# EAGLE schematic PiPowerHat (EAGLE 7.4.0)
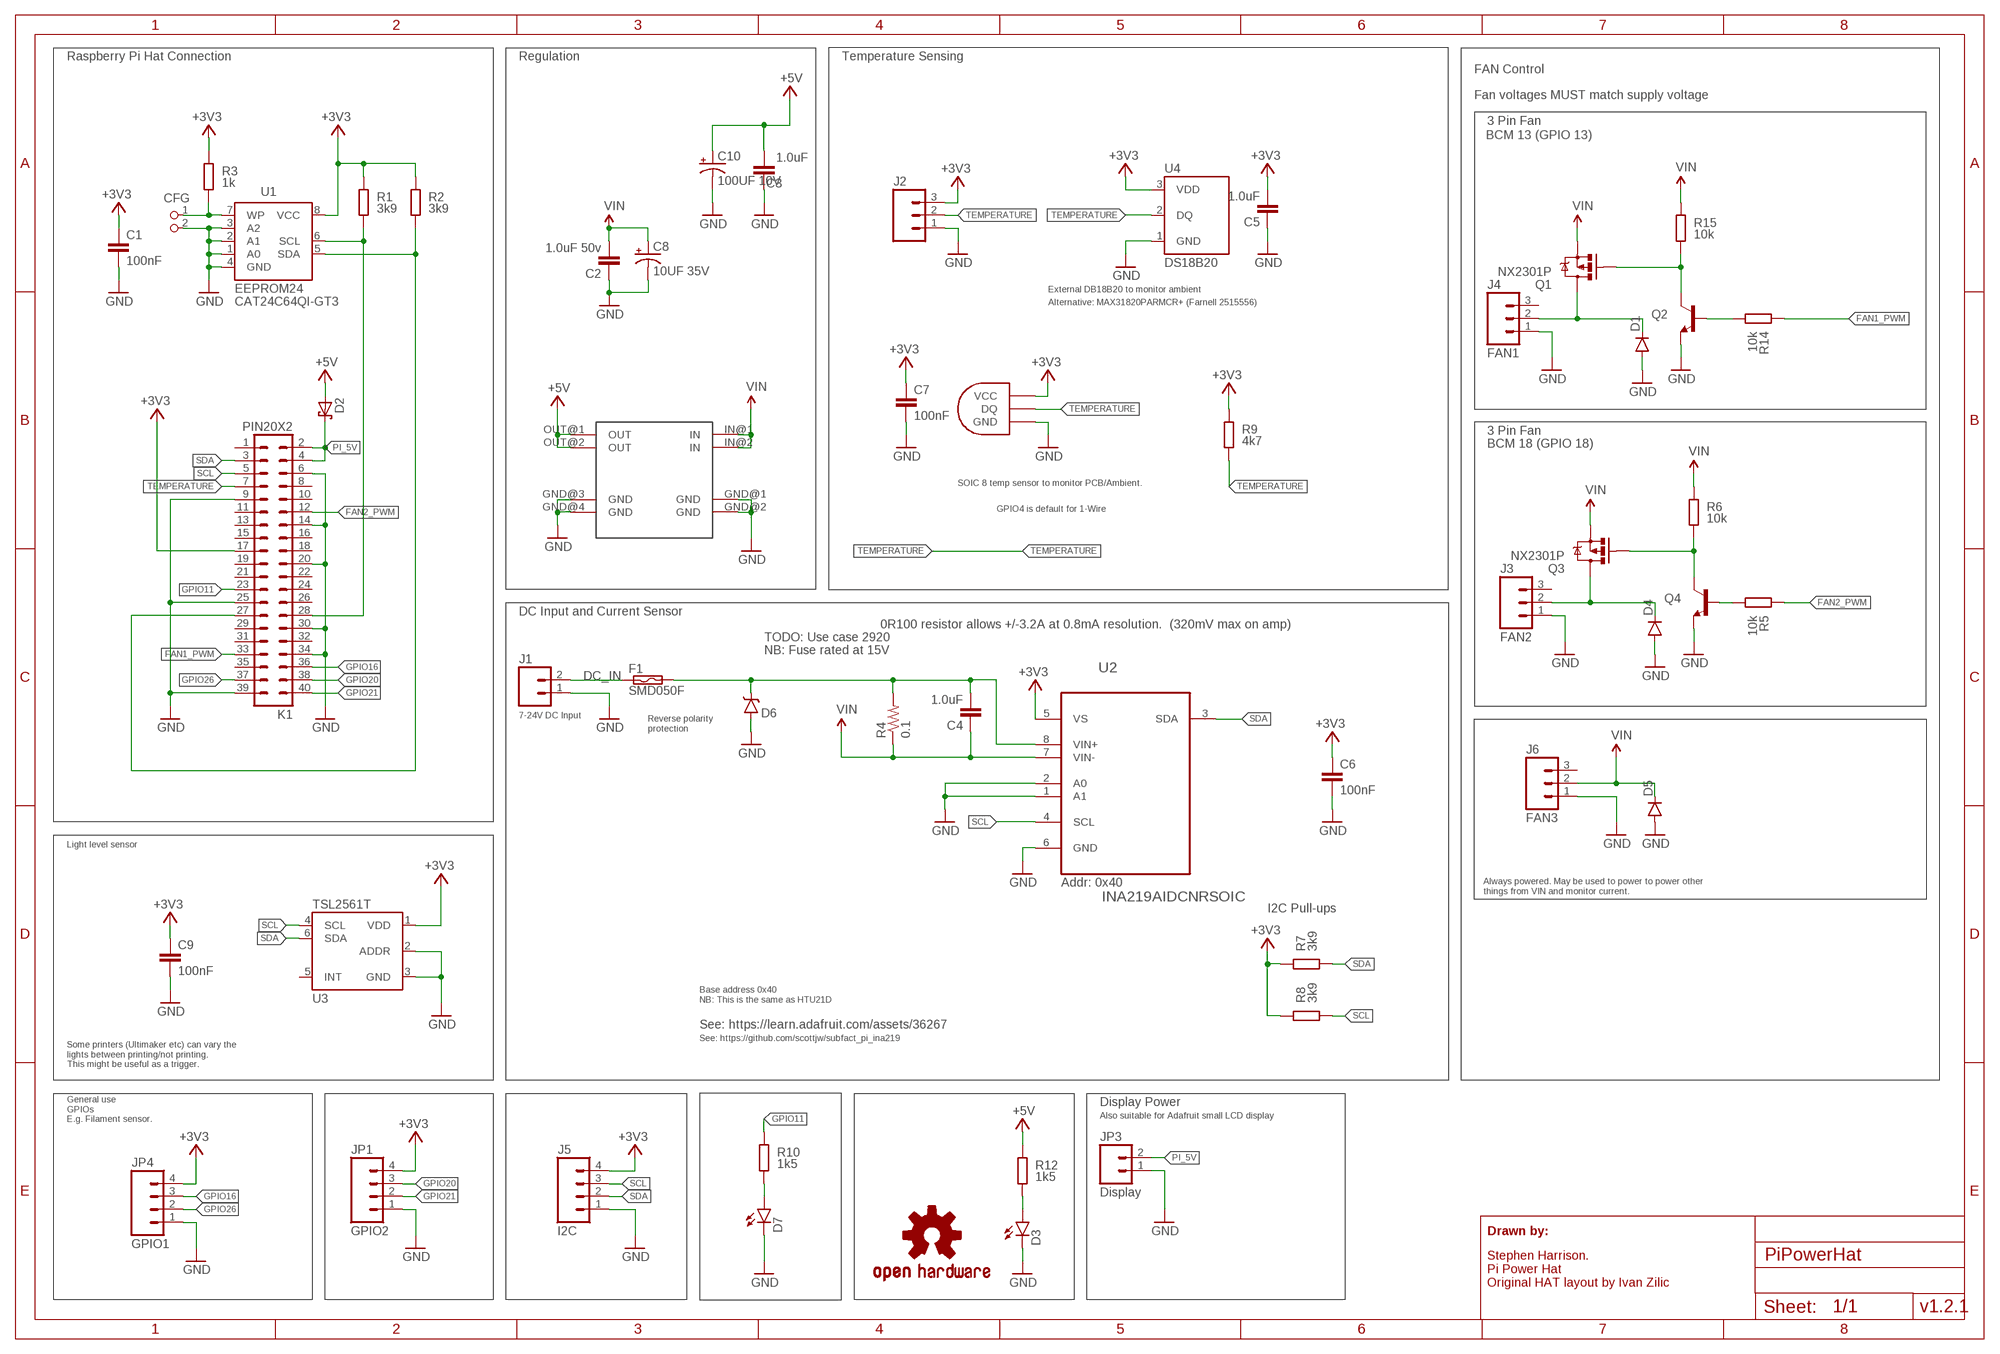
[diagram p0: schematic, sheet 1]

## Parts
C1  100nF  C-EUC0805K  [C0805K]
C2  1.0uF 50v  1.0UF-25V-+80/-20(0805)"  [0805-CAP]
C3  1.0uF  1.0UF-25V-+80/-20(0805)"  [0805-CAP]
C4  1.0uF  1.0UF-25V-+80/-20(0805)"  [0805-CAP]
C5  1.0uF  1.0UF-25V-+80/-20(0805)"  [0805-CAP]
C6  100nF  C-EUC0805K  [C0805K]
C7  100nF  C-EUC0805K  [C0805K]
C8  10UF 35V  10UF-25V-10%(SMT-TANT)  [EIA6032-NOM]
C9  100nF  C-EUC0805K  [C0805K]
C10  100UF 10V  10UF-25V-10%(SMT-TANT)  [EIA6032-NOM]
CFG  PIN2_100  [PIN_W_2]
D1  DIODESOD123  [SOD-123]
D2  MBRS340T3G  SCHOTTKY-DIODESMC  [SMC]
D3  LED1206-BOTTOM  [LED-1206-BOTTOM]
D4  DIODESOD123  [SOD-123]
D5  DIODESOD123  [SOD-123]
D6  B340A  DIODE-SCHOTTKY-B340A  [SMA-DIODE]
D7  LED1206  [LED-1206]
F1  SMD050F  [SMD050F]
J1  M025MM  [SCREWTERMINAL-5MM-2]
J2  M03POLAR  [MOLEX-1X3]
J3  FAN2  M03POLAR  [MOLEX-1X3]
J4  FAN1  M03POLAR  [MOLEX-1X3]
J5  I2C  M04POLAR  [MOLEX-1X4]
J6  FAN3  M03POLAR  [MOLEX-1X3]
JP1  GPIO2  M04POLAR  [MOLEX-1X4]
JP3  Display  M02POLAR  [MOLEX-1X2]
JP4  GPIO1  M04POLAR  [MOLEX-1X4]
K1  PIN20X2  [PIN_20X2]
LOGO1  OSHW-LOGOM  [OSHW-LOGO-M]
Q1  NX2301P  MOSFET-PCHANNEL  [SOT23-3]
Q2  TRANSISTOR_NPNSOT23-3  [SOT23-3]
Q3  NX2301P  MOSFET-PCHANNEL  [SOT23-3]
Q4  TRANSISTOR_NPNSOT23-3  [SOT23-3]
R1  3k9  R-EU_M0805  [M0805]
R2  3k9  R-EU_M0805  [M0805]
R3  1k  R-EU_M0805  [M0805]
R4  0.1  0.001OHM-3W-1%(2512)3W/1%  [2512]
R5  10k  R-EU_M0805  [M0805]
R6  10k  R-EU_M0805  [M0805]
R7  3k9  R-EU_M0805  [M0805]
R8  3k9  R-EU_M0805  [M0805]
R9  4k7  R-EU_M0805  [M0805]
R10  1k5  R-EU_M0805  [M0805]
R12  1k5  R-EU_M0805  [M0805]
R14  10k  R-EU_M0805  [M0805]
R15  10k  R-EU_M0805  [M0805]
RG1  MINI-BUCK-MODULE-3A  [MINI-BUCK-MODULE-3A]
U1  EEPROM24  [SOIC8]
U2  INA219AIDCNRSOIC  [SO08]
U3  TSL2561T  [TMB-6]
U4  DS18B20  [TO-92-AMMO]
U5  DS1820SOIC  [DS18B20_SOIC]

## Nets
+3V3: C1.1 C5.2 C6.1 C7.1 C9.1 J2.3 J5.4 JP1.4 JP4.4 K1.17 R1.2 R2.2 R3.2 R7.2 R8.2 R9.2 U1.8(VCC) U2.5(VS) U3.1(VDD) U4.3(VDD) U5.VCC
+5V: C3.2 C10.A(+) D2.A R12.2 RG1.OUT@1(OUT) RG1.OUT@2(OUT)
DC_IN: F1.1 J1.2
FAN1_PWM: K1.33 R14.2
FAN2_PWM: K1.12 R5.2
GND: C1.2 C2.1 C3.1 C5.1 C6.2 C7.2 C8.C(-) C9.2 C10.C(-) CFG.2 D1.A D3.C D4.A D5.A D6.A D7.C J1.1 J2.1 J3.1 J4.1 J5.1 J6.1 JP1.1 JP3.1 JP4.1 K1.6 K1.9 K1.14 K1.20 K1.25 K1.30 K1.34 K1.39 Q2.2(E) Q4.2(E) RG1.GND@1(GND) RG1.GND@2(GND) RG1.GND@3(GND) RG1.GND@4(GND) U1.1(A0) U1.2(A1) U1.3(A2) U1.4(GND) U2.1(A1) U2.2(A0) U2.6(GND) U3.2(ADDR) U3.3(GND) U4.1(GND) U5.GND
GPIO11: K1.23 R10.2
GPIO16: JP4.3 K1.36
GPIO20: JP1.3 K1.38
GPIO21: JP1.2 K1.40
GPIO26: JP4.2 K1.37
ID_SC: K1.28 R1.1 U1.6(SCL)
ID_SD: K1.27 R2.1 U1.5(SDA)
N$1: D4.C J3.2 Q3.3(D)
N$2: Q4.1(B) R5.1
N$3: CFG.1 R3.1 U1.7(WP)
N$4: D3.A R12.1
N$5: C4.2 D6.C F1.2 R4.2 U2.8(VIN+)
N$6: Q3.1(G) Q4.3(C) R6.1
N$7: D1.C J4.2 Q1.3(D)
N$8: Q1.1(G) Q2.3(C) R15.1
N$9: D7.A R10.1
N$13: Q2.1(B) R14.1
PI_5V: D2.C JP3.2 K1.2 K1.4
SCL: J5.3 K1.5 R8.1 U2.4(SCL) U3.4(SCL)
SDA: J5.2 K1.3 R7.1 U2.3(SDA) U3.6(SDA)
TEMPERATURE: J2.2 K1.7 R9.1 U4.2(DQ) U5.DQ
VIN: C2.2 C4.1 C8.A(+) D5.C J6.2 Q1.2(S) Q3.2(S) R4.1 R6.2 R15.2 RG1.IN@1(IN) RG1.IN@2(IN) U2.7(VIN-)
Unconnected: J3.3 J4.3 J6.3 K1.1 K1.8 K1.10 K1.11 K1.13 K1.15 K1.16 K1.18 K1.19 K1.21 K1.22 K1.24 K1.26 K1.29 K1.31 K1.32 K1.35 U3.5(INT)

## Notes on the sheet
- Raspberry Pi Hat Connection | Regulation | Temperature Sensing
- FAN Control
- Fan voltages MUST match supply voltage
- 3 Pin Fan
- BCM 13 (GPIO 13)
- External DB18B20 to monitor ambient
- CAT24C64QI-GT3 | Alternative: MAX31820PARMCR+ (Farnell 2515556)
- 3 Pin Fan
- BCM 18 (GPIO 18)
- SOIC 8 temp sensor to monitor PCB/Ambient.
- GPIO4 is default for 1-Wire
- DC Input and Current Sensor
- 0R100 resistor allows +/-3.2A at 0.8mA resolution.  (320mV max on amp)
- TODO: Use case 2920
- NB: Fuse rated at 15V
- 7-24V DC Input
- Reverse polarity
  protection
- Light level sensor
- Addr: 0x40
- Always powered. May be used to power to power other
  things from VIN and monitor current.
- I2C Pull-ups
- Base address 0x40
  NB: This is the same as HTU21D
- See: https://learn.adafruit.com/assets/36267
- See: https://github.com/scottjw/subfact_pi_ina219
- Some printers (Ultimaker etc) can vary the 
  lights between printing/not printing. 
  This might be useful as a trigger.
- Display Power
- Also suitable for Adafruit small LCD display
- General use
  GPIOs
  E.g. Filament sensor.
- Drawn by:
- Stephen Harrison.
  Pi Power Hat 
  Original HAT layout by Ivan Zilic
- v1.2.1

## Library data of the parts
C1 C6 C7 C9 = resistor:C-EU: CAPACITOR, European symbol; DIELECTRIC: X7R
C2 = SparkFun-Capacitors:1.0UF-25V-+80/-20(0805): CAP-11625; PROD_ID: CAP-11625; VALUE: 1.0uF
C3-C5 = SparkFun-Capacitors:1.0UF-25V-+80/-20(0805): CAP-11625; PROD_ID: CAP-11625
C8 = SparkFun-Capacitors:10UF-25V-10%(SMT-TANT): http://www.digikey.com/product-detail/en/T491C106K025AT7280/399-10159-2-ND/3759638; FARNELL: 197634; PROD_ID: CAP-12984
C10 = SparkFun-Capacitors:10UF-25V-10%(SMT-TANT): http://www.digikey.com/product-detail/en/T491C106K025AT7280/399-10159-2-ND/3759638; PROD_ID: CAP-12984
CFG = FLYFISH:PIN2
D1 D4 D5 = SparkFun-DiscreteSemi:DIODE: Diode These are standard reverse protection diodes and small signal diodes. SMA package can handle up to about 1A. SOD-323 can handle about 200mA. What the SOD-323 package when ordering, there are some mfgs out there that are 5-pin packages.
D2 = diode:SCHOTTKY-DIODE: Schottky Diode; FARNELL: 9557377
D3 D7 = SparkFun-LED:LED: LEDs Standard schematic elements and footprints for 5mm, 3mm, 1206, and 0603 sized LEDs. 5mm - Spark Fun Electronics SKU : COM-00529 (and others)
D6 = SparkFun-DiscreteSemi:DIODE-SCHOTTKY: Schottky diodes in SFE's production catalog BAT20J 1A 23V 0.62Vf RB751 120mA 40V 0.37Vf PMEG4005EJ 0.5A 40V 0.42Vf MBRA140 1A 40V 0.5Vf B340A 3A 40V SMA; PROD_ID: DIO-09886
F1 = switch-raychem:SMD*F: PolySwitch (TM) Resettable Device Source: Data sheet <http://www.farnell.com/datasheets/13482.pdf>; FARNELL: 1822231; FARNELL-NEW: 1822225
J1 = SparkFun-Connectors:M02: Standard 2-pin 0.1" header. Use with - straight break away headers ( PRT-00116) - right angle break away headers (PRT-00553) - swiss pins (PRT-00743) - machine pins (PRT-00117) - female headers (PRT-00115) Molex polarized connector foot print use with: PRT-08233 with associated crimp pins and housings. 2.54_SCREWTERM for use with PRT-10571. 3.5mm Screw Terminal footprints for PRT-08084 5mm Screw Terminal footprints for use with PRT-08432; STOREFRONT_ID: PRT-08432
J2-J4 J6 = SparkFun-Connectors:M03: Header 3 Standard 3-pin 0.1" header. Use with straight break away headers (SKU : PRT-00116), right angle break away headers (PRT-00553), swiss pins (PRT-00743), machine pins (PRT-00117), and female headers (PRT-00115). Molex polarized connector foot print use with SKU : PRT-08232 with associated crimp pins and housings.
J5 JP1 JP4 = SparkFun-Connectors:M04: Header 4 Standard 4-pin 0.1" header. Use with straight break away headers (SKU : PRT-00116), right angle break away headers (PRT-00553), swiss pins (PRT-00743), machine pins (PRT-00117), and female headers (PRT-00115). Molex polarized connector foot print use with SKU : PRT-08231 with associated crimp pins and housings. 1MM SMD Version SKU: PRT-10208
JP3 = SparkFun-Connectors:M02: Standard 2-pin 0.1" header. Use with - straight break away headers ( PRT-00116) - right angle break away headers (PRT-00553) - swiss pins (PRT-00743) - machine pins (PRT-00117) - female headers (PRT-00115) Molex polarized connector foot print use with: PRT-08233 with associated crimp pins and housings. 2.54_SCREWTERM for use with PRT-10571. 3.5mm Screw Terminal footprints for PRT-08084 5mm Screw Terminal footprints for use with PRT-08432
K1 = FLYFISH:PIN20X2
LOGO1 = SparkFun-Aesthetics:OSHW-LOGO: Open Source Hardware Logo This logo indicates the piece of hardware it is found on incorporates a OSHW license and/or adheres to the definition of open source hardware found here: http://freedomdefined.org/OSHW
Q1 Q3 = SparkFun-DiscreteSemi:MOSFET-PCHANNEL: Generic PMOSFET IRLML2244 - TRANS-11153 (SOT-23 -20V -4.3A) (1.Gate 2.Source 3.Drain) FQP27P06 - COM-10349 <http://www.sparkfun.com/products/10349> (TO-220 -60V -27A) (1.Gate 2.Source 3.Drain); PROD_ID: TRANS-08285
Q2 Q4 = SparkFun-DiscreteSemi:TRANSISTOR_NPN: Generic NPN BJT MMBT2222A - TRANS-08049 (SOT-23, 1A 40V) MPSA42 - TRANS-09116 (SOT-23, 500mA 300V) MMBT5088LT1G - TRANS-11160 (SOT-23, 50 mA 30V) BC547 - COM-08928 <http://www.sparkfun.com/products/8928> (TO-92 45V 100mA) (1.Collector 2.Base 3.Emitter) 2N3904 - COM-00521 <http://www.sparkfun.com/products/521> (TO-92 40V 200mA) (1.Emitter 2.Base 3.Collector) P2N2222A - COM-12852 <http://www.sparkfun.com/products/12852> (TO-92 40V 600mA) (1.Collector 2.Base 3.Emitter); PROD_ID: TRANS-08049
R1-R3 R5-R10 R12 R14 R15 = resistor:R-EU_: RESISTOR, European symbol; TOLERANCE: 5%
R4 = SparkFun-Resistors:0.001OHM-3W-1%(2512); PROD_ID: RES-12449; VALUE: 0.001
RG1 = Tinamous:MINI-BUCK-MODULE-3A
U1 = FLYFISH:EEPROM24; FARNELL: 2463718
U2 = INA219AIDCNR:INA219AIDCNR: CURRENT/POWER MONITOR
U3 = SparkFun-Sensors:TSL2561: TSL2561 illumination sensor Approximates Human Eye Response Precisely Measures Illuminance Programmable Interrupt Function with User-Defined Upper and Lower Threshold 400 KHz I2C interface Programmable Analog Gain and Integration Time Supporting 1,000,000-to-1 Dynamic Range Automatically Rejects 50/60-Hz Lighting Ripple Low Active Power (0.75 mW Typical) with Power Down Mode RoHS Compliant The TSL2561 is a light-to-digital converter that transform light intensity to a digital signal output via I2C interface. The device combines one broadband photodiode (visible plus infrared) and one infrared-responding photodiode on a single CMOS integrated circuit capable of providing a near-photopic response over an effective 20-bit dynamic range (16-bit resolution). Two integrating ADCs convert the photodiode currents to a digital output that represents the irradiance measured on each channel. This digital output can be input to a microprocessor where illuminance (ambient light level) in lux is derived using an empirical formula to approximate the human eye response. The TSL2561 device supports a traditional level style interrupt that remains asserted until the firmware clears it.
U4 = SparkFun-Sensors:DS18B20: Dallas/Maxim DS18B20 1-wire temperature sensor Datasheet: http://datasheets.maximintegrated.com/en/ds/DS18B20.pdf temp thermometer 1-wire one-wire one wire; STORE_ID: SEN-00245
U5 = DS1820-SOIC:DS1820